# EAGLE design Motor_Controller_Shield (EAGLE 9.6.2)
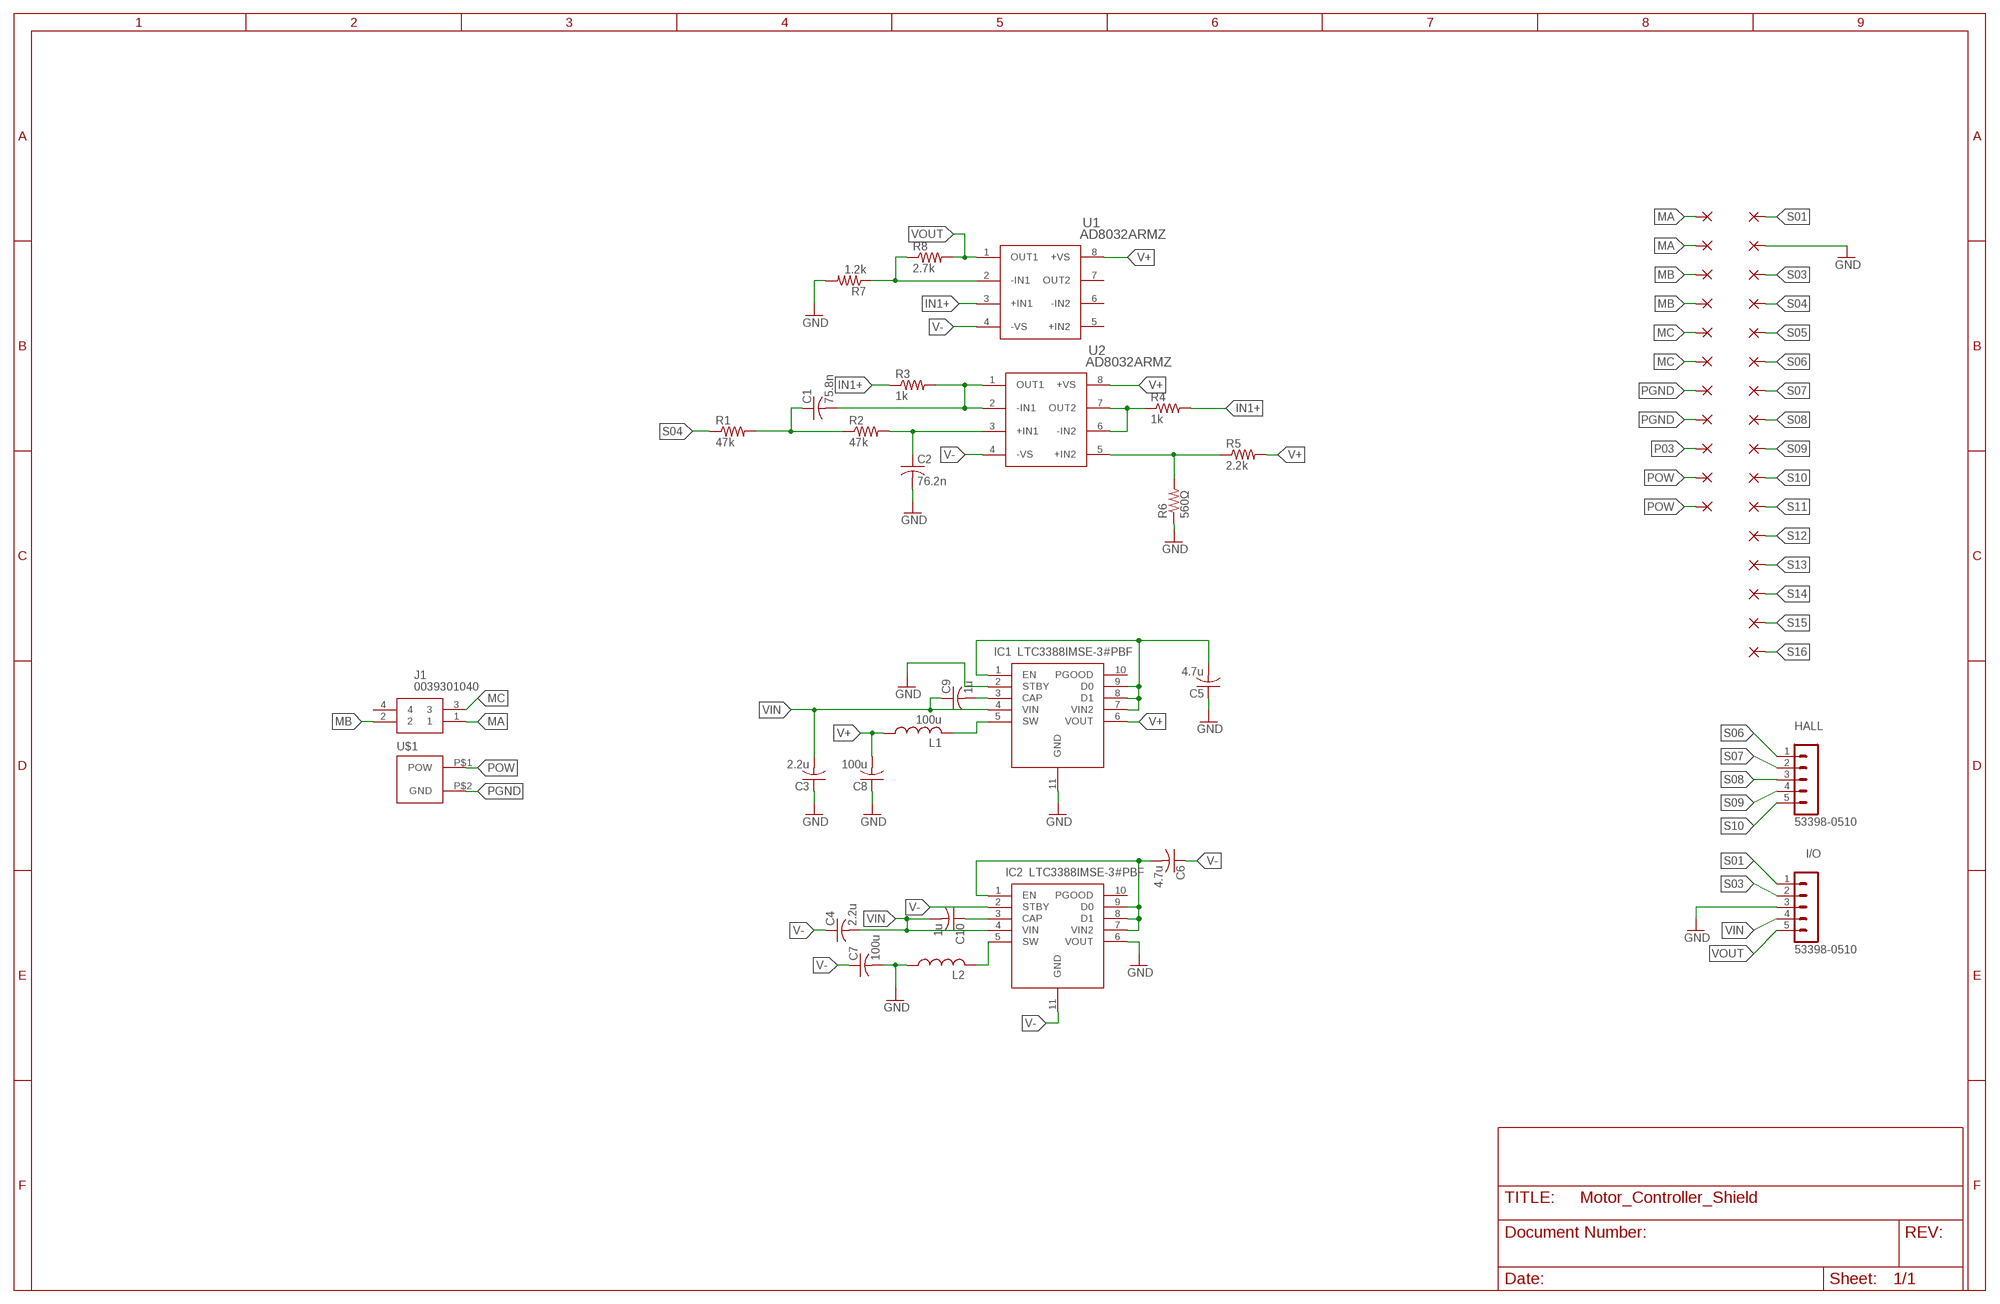
[diagram p0: schematic, sheet 1]

## Parts
C1  75.8n  C-USC0805  [C0805]
C2  76.2n  C-USC0805  [C0805]
C3  2.2u  C-USC0805  [C0805]
C4  2.2u  C-USC0805  [C0805]
C5  4.7u  C-USC0805  [C0805]
C6  4.7u  C-USC0805  [C0805]
C7  100u  C-USC0805  [C0805]
C8  100u  C-USC0805  [C0805]
C9  1u  C-USC0805  [C0805]
C10  1u  C-USC0805  [C0805]
HALL  53398-0510  [53398-0510]
I/O  53398-0510  [53398-0510]
IC1  LTC3388IMSE-3#PBF  [SOP50P490X110-11N]
IC2  LTC3388IMSE-3#PBF  [SOP50P490X110-11N]
J1  0039301040  [0039301040]
L1  100u  L-USL2012C  [L2012C]
L2  L-USL2012C  [L2012C]
P01  1,6/0,9  [1,6/0,9]
P02  1,6/0,9  [1,6/0,9]
P03  1,6/0,9  [1,6/0,9]
P04  1,6/0,9  [1,6/0,9]
P05  1,6/0,9  [1,6/0,9]
P06  1,6/0,9  [1,6/0,9]
P07  1,6/0,9  [1,6/0,9]
P08  1,6/0,9  [1,6/0,9]
P09  1,6/0,9  [1,6/0,9]
P10  1,6/0,9  [1,6/0,9]
P11  1,6/0,9  [1,6/0,9]
R1  47k  R-US_R0805  [R0805]
R2  47k  R-US_R0805  [R0805]
R3  1k  R-US_R0805  [R0805]
R4  1k  R-US_R0805  [R0805]
R5  2.2k  R-US_R0805  [R0805]
R6  560Ω  R-US_R0805  [R0805]
R7  1.2k  R-US_R0805  [R0805]
R8  2.7k  R-US_R0805  [R0805]
S01  1,6/0,9  [1,6/0,9]
S02  1,6/0,9  [1,6/0,9]
S03  1,6/0,9  [1,6/0,9]
S04  1,6/0,9  [1,6/0,9]
S05  1,6/0,9  [1,6/0,9]
S06  1,6/0,9  [1,6/0,9]
S07  1,6/0,9  [1,6/0,9]
S08  1,6/0,9  [1,6/0,9]
S09  1,6/0,9  [1,6/0,9]
S10  1,6/0,9  [1,6/0,9]
S11  1,6/0,9  [1,6/0,9]
S12  1,6/0,9  [1,6/0,9]
S13  1,6/0,9  [1,6/0,9]
S14  1,6/0,9  [1,6/0,9]
S15  1,6/0,9  [1,6/0,9]
S16  1,6/0,9  [1,6/0,9]
U1  AD8032ARMZ  [RM_8]
U2  AD8032ARMZ  [RM_8]
U$1  JR_2PM_DEV  [JR_2PM_B_FP]

## Nets
GND: C2.2 C3.1 C5.1 C7.2 C8.1 I/O.3 IC1.2(STBY) IC1.11(GND) IC2.6(VOUT) L2.1 R6.1 R7.2 S02.1(P)
IN1+: R3.1 R4.2 U1.3(+IN1)
MA: J1.1 P01.1(P) P02.1(P)
MB: J1.2 P03.1(P) P04.1(P)
MC: J1.3 P05.1(P) P06.1(P)
N$1: IC2.5(SW) L2.2
N$2: C1.2 R3.2 U2.1(OUT1) U2.2(-IN1)
N$3: C1.1 R1.2 R2.1
N$4: C2.1 R2.2 U2.3(+IN1)
N$6: C6.2 IC2.1(EN) IC2.7(VIN2) IC2.8(D1) IC2.9(D0)
N$7: R5.1 R6.2 U2.5(+IN2)
N$9: C10.1 IC2.3(CAP)
N$10: R4.1 U2.6(-IN2) U2.7(OUT2)
N$13: R7.1 R8.1 U1.2(-IN1)
N$16: C5.2 IC1.1(EN) IC1.7(VIN2) IC1.8(D1) IC1.9(D0)
N$20: C9.2 IC1.3(CAP)
N$22: IC1.5(SW) L1.2
P03: P09.1(P)
PGND: P07.1(P) P08.1(P) U$1.P$2(GND)
POW: P10.1(P) P11.1(P) U$1.P$1(POW)
S01: I/O.1 S01.1(P)
S03: I/O.2 S03.1(P)
S04: R1.1 S04.1(P)
S05: S05.1(P)
S06: HALL.1 S06.1(P)
S07: HALL.2 S07.1(P)
S08: HALL.3 S08.1(P)
S09: HALL.4 S09.1(P)
S10: HALL.5 S10.1(P)
S11: S11.1(P)
S12: S12.1(P)
S13: S13.1(P)
S14: S14.1(P)
S15: S15.1(P)
S16: S16.1(P)
V+: C8.2 IC1.6(VOUT) L1.1 R5.2 U1.8(+VS) U2.8(+VS)
V-: C4.1 C6.1 C7.1 IC2.2(STBY) IC2.11(GND) U1.4(-VS) U2.4(-VS)
VIN: C3.2 C4.2 C9.1 C10.2 I/O.4 IC1.4(VIN) IC2.4(VIN)
VOUT: I/O.5 R8.2 U1.1(OUT1)
Unconnected: IC1.10(PGOOD) IC2.10(PGOOD) J1.4 U1.5(+IN2) U1.6(-IN2) U1.7(OUT2)

## Library data of the parts
C1-C10 = rcl:C-US: CAPACITOR, American symbol; SPICEPREFIX: C
HALL I/O = con-molex-picoblade:53398-0510: HEADER
IC1 IC2 = LTC3388IMSE-3#PBF:LTC3388IMSE-3#PBF: Switching Voltage Regulators 20V/50mA High Efficiency Step-Down Regulator with <1uA Quiescent Current Source: Datasheet <https://www.analog.com/media/en/technical-documentation/data-sheets/338813fa.pdf>; ARROW_PART_NUMBER: LTC3388IMSE-3#PBF; ARROW_PRICE-STOCK: https://www.arrow.com/en/products/ltc3388imse-3pbf/analog-devices?region=nac; DESCRIPTION: Switching Voltage Regulators 20V/50mA High Efficiency Step-Down Regulator with <1uA Quiescent Current; HEIGHT: 1.1mm; MANUFACTURER_NAME: Analog Devices; MANUFACTURER_PART_NUMBER: LTC3388IMSE-3#PBF; MOUSER_PART_NUMBER: 584-LTC3388IMSE-3PBF; MOUSER_PRICE-STOCK: https://www.mouser.co.uk/ProductDetail/Analog-Devices/LTC3388IMSE-3PBF?qs=hVkxg5c3xu%252BRZEM3kCY9DA%3D%3D
J1 = 0039301040:0039301040: Conn Wire to Board HDR 4Power POS 4.2mm Solder RA Side Entry Thru-Hole Bag Source: Datasheet <https://www.molex.com/pdm_docs/pk/PK-5569-002.pdf>; ARROW_PART_NUMBER: 0039301040; ARROW_PRICE-STOCK: https://www.arrow.com/en/products/0039301040/molex?region=nac; DESCRIPTION: Conn Wire to Board HDR 4Power POS 4.2mm Solder RA Side Entry Thru-Hole Bag; HEIGHT: 10mm; MANUFACTURER_NAME: Molex; MANUFACTURER_PART_NUMBER: 0039301040; MOUSER_PART_NUMBER: N/A; MOUSER_PRICE-STOCK: https://www.mouser.co.uk/ProductDetail/Molex/0039301040?qs=PBcRNPEHKsrbVy%2FlkLEDxA%3D%3D
L1 L2 = rcl:L-US: INDUCTOR, American symbol; SPICEPREFIX: L
P01-P09 P10 P11 S01-S09 S10-S16 = wirepad:1,6/0,9: THROUGH-HOLE PAD
R1-R8 = rcl:R-US_: RESISTOR, American symbol; SPICEPREFIX: R
U1 U2 = AD8032ARMZ:AD8032ARMZ; MANUFACTURER_PART_NUMBER: AD8032ARMZ; VENDOR: Analog Devices Inc
U$1 = molex_power_connector:JR_2PM_DEV

## Board
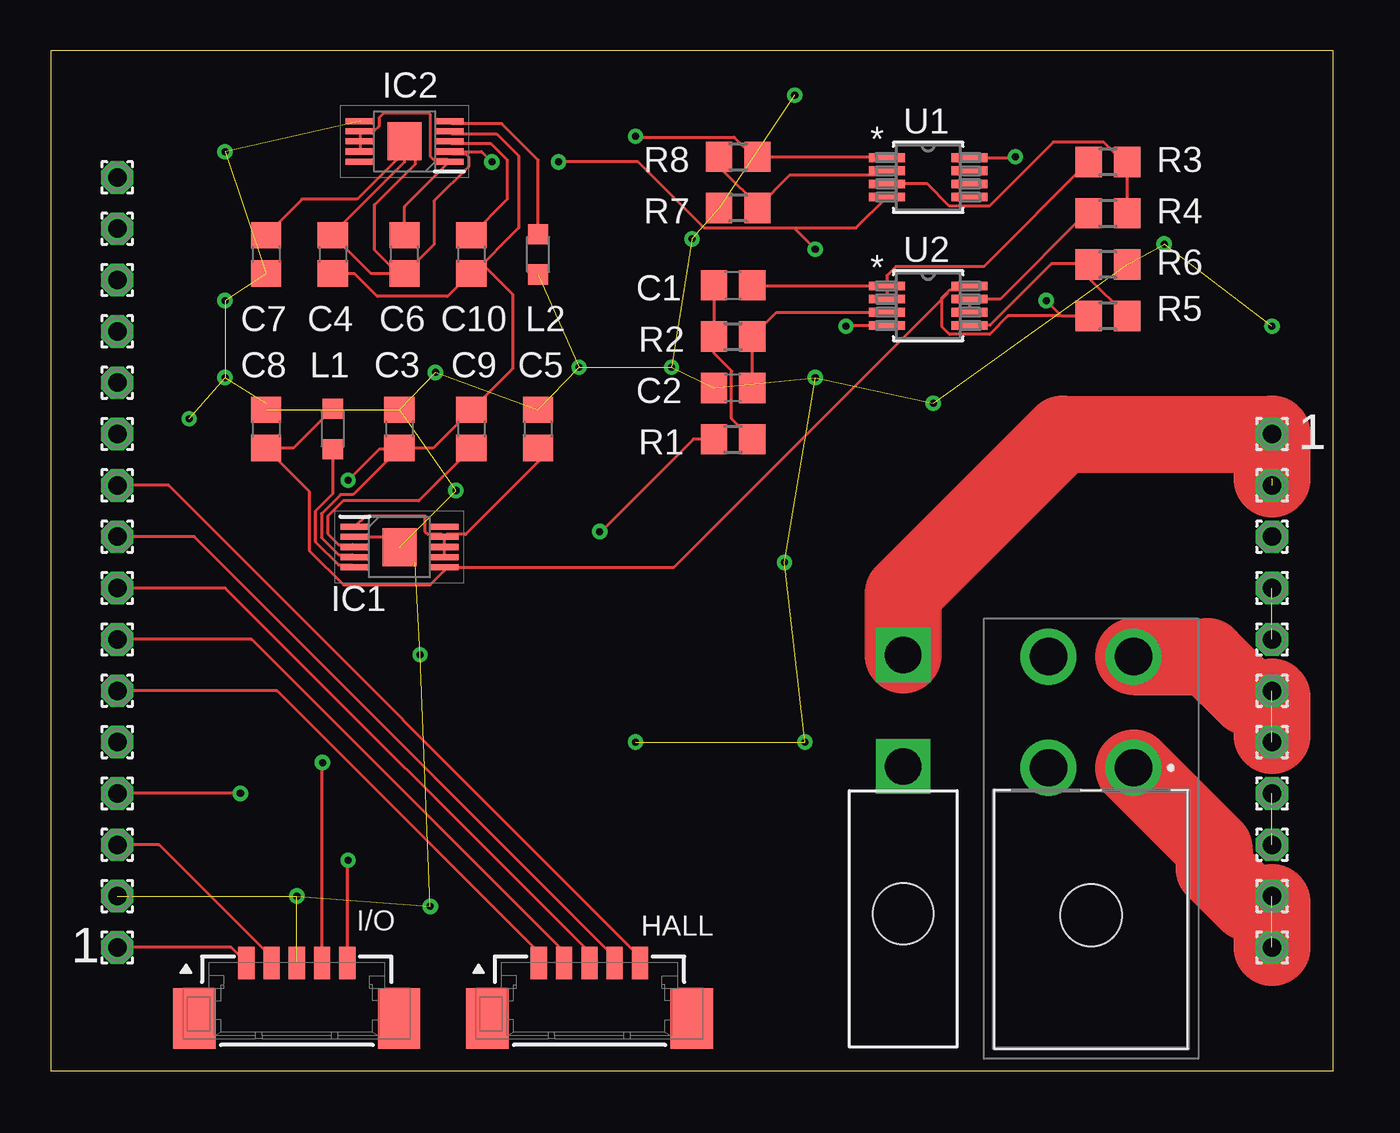
[diagram p1: board, top side]
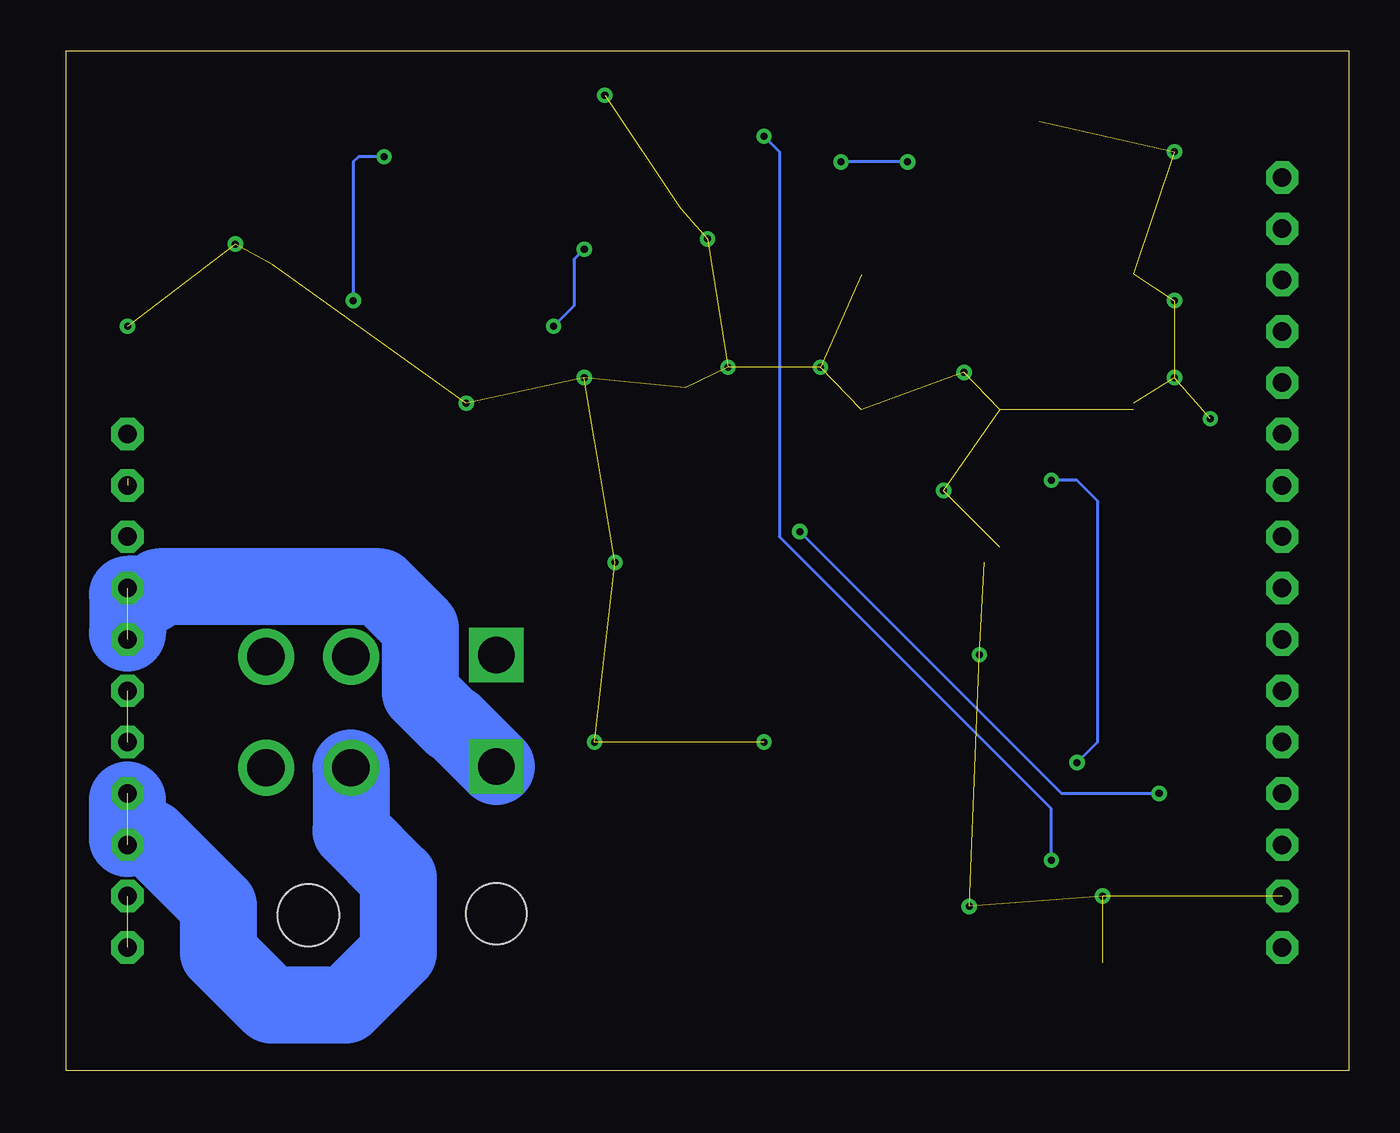
[diagram p2: board, bottom side, seen from below]

Size 63.48 x 50.47 mm. Coordinates in mm from the lower left corner, seen from the top.
Outline: 0,0 63.48,0 63.48,50.47 0,50.47 0,0
Copper layers (1*16): Top 0.035mm / dielectric 1.5mm / Bottom 0.035mm
Design rules "default": minimum track width 6mil, minimum drill 0.35mm, track to track 6mil, track to pad 6mil, pad to pad 6mil, via to via 6mil, smd to smd 6mil, copper to edge 40mil, drill to drill 6mil, minimum pad ring 10mil, minimum via ring 8mil, stop-mask expansion 4mil, vias tented up to drill 0mil, thermal gap 10mil

### Footprints (pad centres in the part's own frame; a part is rotated, then mirrored left to right if it is on the bottom)
C0805 = smd 1.3 x 1.5: 1 -0.95,0; 2 0.95,0
53398-0510 = smd 0.8 x 1.6: 1 2.5,0; 2 1.25,0; 3 0,0; 4 -1.25,0; 5 -2.5,0 | smd 2.1 x 3: M1 5.06,2.75; M2 -5.06,2.75
SOP50P490X110-11N = smd 1.425 x 0.3: 1 -2.212,1; 2 -2.212,0.5; 3 -2.212,0; 4 -2.212,-0.5; 5 -2.212,-1; 6 2.212,-1; 7 2.212,-0.5; 8 2.212,0; 9 2.212,0.5; 10 2.212,1 | smd 1.68 x 1.88: 11 0,0
0039301040 = drill 1.85 pad 2.775: 1 0,0; 2 -4.2,0; 3 0,5.5; 4 -4.2,5.5 | hole 3.05: -2.1,-7.3
L2012C = smd 1 x 1: 1 -1,0; 2 1,0
1,6/0,9 = drill 0.914 pad 1.6 octagon: 1 0,0
R0805 = smd 1.3 x 1.5: 1 -0.95,0; 2 0.95,0
RM_8 = smd 1.778 x 0.432: 1 -2.045,0.975; 2 -2.045,0.325; 3 -2.045,-0.325; 4 -2.045,-0.975; 5 2.045,-0.975; 6 2.045,-0.325; 7 2.045,0.325; 8 2.045,0.975
JR_2PM_B_FP = drill 1.803 square: P$1 2.667,19.406; P$2 2.667,13.894 | hole 2.997: 2.667,6.604

### Placement (x,y rotation side)
C1  33.78,38.86 0 top
C2  33.78,33.78 180 top
C3  17.27,31.75 270 top
C4  13.97,40.39 270 top
C5  24.13,31.75 270 top
C6  17.53,40.39 90 top
C7  10.67,40.39 270 top
C8  10.67,31.75 270 top
C9  20.83,31.75 270 top
C10  20.83,40.39 270 top
HALL  26.67,5.33 180 top
I/O  12.19,5.33 180 top
IC1  17.27,25.91 0 top
IC2  17.53,45.97 180 top
J1  53.59,14.99 0 top
L1  13.97,31.75 270 top
L2  24.13,40.39 90 top
P01  60.45,6.1 0 top
P02  60.45,8.64 0 top
P03  60.45,11.18 0 top
P04  60.45,13.72 0 top
P05  60.45,16.26 0 top
P06  60.45,18.8 0 top
P07  60.45,21.34 0 top
P08  60.45,23.88 0 top
P09  60.45,26.42 0 top
P10  60.45,28.96 0 top
P11  60.45,31.5 0 top
R1  33.78,31.24 0 top
R2  33.78,36.32 0 top
R3  52.32,44.96 180 top
R4  52.32,42.42 0 top
R5  52.32,37.34 180 top
R6  52.32,39.88 180 top
R7  34.04,42.67 180 top
R8  34.04,45.21 0 top
S01  3.3,6.1 0 top
S02  3.3,8.64 0 top
S03  3.3,11.18 0 top
S04  3.3,13.72 0 top
S05  3.3,16.26 0 top
S06  3.3,18.8 0 top
S07  3.3,21.34 0 top
S08  3.3,23.88 0 top
S09  3.3,26.42 0 top
S10  3.3,28.96 0 top
S11  3.3,31.5 0 top
S12  3.3,34.04 0 top
S13  3.3,36.58 0 top
S14  3.3,39.12 0 top
S15  3.3,41.66 0 top
S16  3.3,44.2 0 top
U1  43.43,44.2 0 top
U2  43.43,37.85 0 top
U$1  39.53,1.16 0 top

### Tracks (layer width: path | path; a pad name or v marks a point on that pad's centre or on a via)
GND  (via drill 0.35)  (31 unrouted)
  Top 0.152: IC1.2 16.77,26.41 IC1.11 18.03,25.15 | C8.1 10.67,33.02
  other vias: 26.16,34.8 8.64,38.1 19.05,34.54 20.07,28.7 8.64,34.29 31.75,41.15 30.73,34.8 55.12,40.89 12.19,8.64 36.83,48.26 60.45,36.83 43.69,33.02 37.85,34.29 36.32,25.15 28.96,16.26 18.29,20.57 18.8,8.13 6.86,32.26 8.64,45.47 37.34,16.26
IN1+
  Top 0.152: R4.2 R3.1 53.1,44.96 52.12,45.94 49.62,45.94 46.46,42.78 44.49,42.78 43.4,43.87 U1.3
MA  (1 unrouted)
  Top 3.81: J1.1 57.59,10.99 57.59,9.99 59.27,8.32 60.45,8.32 P01.1
MB  (2 unrouted)
  Bottom 3.81: J1.2 49.39,11.87 47.05,9.53 47.05,5.84 49.65,3.24 53.34,3.24 55.94,5.84 55.94,8.16 59.27,11.49 60.45,11.49 60.45,13.4
MC  (2 unrouted)
  Top 3.81: J1.3 57.26,20.49 59.27,18.48 60.45,18.48 60.45,16.57
N$1
  Top 0.152: IC2.5 19.86,46.85 22.32,46.85 24.13,45.05 L2.2
N$2
  Top 0.152: C1.2 34.77,38.82 U2.1 | U2.1 41.39,39.33 41.83,39.77 46.19,39.77 R3.2 | U2.1 U2.2
N$3
  Top 0.152: C1.1 R2.1 32.83,35.51 33.71,34.63 33.71,32.26 R1.2
N$4
  Top 0.152: C2.1 R2.2 35.93,37.52 U2.3
N$6
  Top 0.152: C6.2 17.53,42.76 IC2.1 19.62,45.09 18.93,45.09 18.8,45.23 18.8,47.31 18.71,47.4 16.51,47.4 | 16.46,47.4 16.51,47.4 | 15.57,45.47 IC2.9 IC2.8 IC2.7 16,46.47 16.25,46.73 16.25,47.14 16.51,47.4
N$7
  Top 0.152: U2.5 46.49,36.87 49.54,39.92 51.33,39.92 R6.2 51.37,39.24 R5.1
N$9
  Top 0.152: C10.1 22.61,43.11 22.61,45.06 21.82,45.85 19.86,45.85 IC2.3
N$10
  Top 0.152: R4.1 51.25,42.42 47,38.17 U2.7 U2.6
N$13
  Top 0.152: U1.2 41.18,44.32 36.6,44.32 35.05,42.77 33.34,44.48 33.34,44.96 R8.1 | R7.1 35.05,42.67
N$16
  Top 0.152: IC1.9 19.61,26.53 20.55,26.53 24.13,30.11 C5.2 | IC1.9 IC1.8 IC1.7 | IC1.9 19.36,26.53 18.68,26.53 18.54,26.66 18.54,27.43 15.58,27.43 IC1.1
N$20
  Top 0.152: C9.2 18.22,28.19 14.48,28.19 13.72,27.43 13.72,26.57 14.25,26.03 14.94,26.03 IC1.3
N$22
  Top 0.152: IC1.5 14.94,25.03 14.25,25.03 13.11,26.18 13.11,27.68 13.97,28.55 L1.2
PGND  (2 unrouted)
  Bottom 3.81: U$1.P$2 44.3,17.16 44.41,17.16 45.95,18.7 45.95,21.91 47.97,23.93 58.9,23.93 59.27,23.56 60.45,23.56 60.45,21.65
POW  (1 unrouted)
  Top 3.81: U$1.P$1 42.2,23.61 50.08,31.5 P11.1 60.45,29.27
S01
  Top 0.152: I/O.1 8.93,6.1 S01.1
S03
  Top 0.152: I/O.2 10.94,5.61 5.37,11.18 S03.1
S04  (via drill 0.35)
  Top 0.152: R1.1 31.82,31.24 27.24,26.67 v27.18,26.67 | v9.4,13.72 S04.1
  Bottom 0.152: v27.18,26.67 14.22,13.72 v9.4,13.72
S06
  Top 0.152: HALL.1 24.17,5.84 11.22,18.8 S06.1
S07
  Top 0.152: HALL.2 25.31,5.45 25.31,5.97 9.95,21.34 S07.1
S08
  Top 0.152: 26.42,5.08 HALL.3 26.56,5.45 26.56,5.97 8.65,23.88 S08.1
S09
  Top 0.152: HALL.4 27.81,5.45 27.81,5.72 7.11,26.42 S09.1
S10
  Top 0.152: HALL.5 29.06,5.45 29.06,5.74 5.84,28.96 S10.1
V+  (via drill 0.35)
  Top 0.152: L1.1 12.02,30.8 C8.2 12.8,28.67 12.8,25.73 14.5,24.03 18.79,24.03 19.48,24.72 19.48,24.89 | 19.48,24.89 IC1.6 | 50.04,37.34 47.39,37.34 46.48,36.43 44.49,36.43 44.11,36.81 44.11,38.23 44.36,38.48 | U1.8 47.75,45.17 v47.75,45.21 | v49.28,38.1 50.04,37.34 | 50.04,37.34 R5.2 | U2.8 45.27,38.62 44.49,38.62 44.36,38.48 | 44.36,38.48 44.36,38.41 30.84,24.89 19.48,24.89
  Bottom 0.152: v47.75,45.21 49.02,45.21 49.28,44.96 v49.28,38.1
V-  (via drill 0.35)
  Top 0.152: IC2.11 17.53,45.47 15.17,43.11 12.45,43.11 C7.1 | IC2.11 17.53,44.96 13.97,41.4 C4.1 15.87,39.44 C6.1 | C6.1 17.2,39.44 16.04,40.59 16.04,42.84 18.03,44.84 18.03,45.47 IC2.11 | C6.1 18.98,40.89 18.98,43.03 20.68,44.73 20.68,45.22 20.55,45.35 19.86,45.35 IC2.2 21.33,45.47 v21.84,44.96 | U1.4 39.86,41.69 36.79,41.69 | v25.15,44.96 29.08,44.96 32.34,41.69 36.79,41.69 | 36.79,41.69 v37.85,40.64 | v39.37,36.83 39.41,36.87 U2.4
  Bottom 0.152: v21.84,44.96 v25.15,44.96 | v37.85,40.64 38.35,40.13 38.35,37.85 v39.37,36.83
VIN  (via drill 0.35)
  Top 0.152: 13.19,5.59 I/O.4 | 13.55,5.45 I/O.4 | C3.2 18.93,30.8 C9.1 22.86,34.73 22.86,38.42 21.34,39.94 C10.2 | IC1.4 14.94,25.53 14.25,25.53 13.41,26.37 13.41,27.56 14.35,28.5 14.97,28.5 C3.2 | IC2.4 19.86,46.35 22.07,46.35 23.16,45.26 23.16,41.7 20.91,39.44 C10.2 | C10.2 20.77,39.44 19.64,38.3 16.17,38.3 15.04,39.44 C4.2 | I/O.4 13.44,15.22 v13.46,15.24 | v14.73,29.21 16.26,30.73 17.21,30.73 C3.2
  Bottom 0.152: v13.46,15.24 12.45,16.26 12.45,28.19 13.46,29.21 v14.73,29.21
VOUT  (via drill 0.35)
  Top 0.152: U1.1 41.35,45.21 R8.2 34.81,45.21 33.83,46.19 28.99,46.19 v28.96,46.23 | I/O.5 14.69,10.37 v14.73,10.41
  Bottom 0.152: v14.73,10.41 14.73,12.95 28.19,26.42 28.19,45.47 v28.96,46.23

### Text on the board
tNames: 1 | 1